# Altium schematic sheet Chassis.SchDoc
size 393 x 241 mm
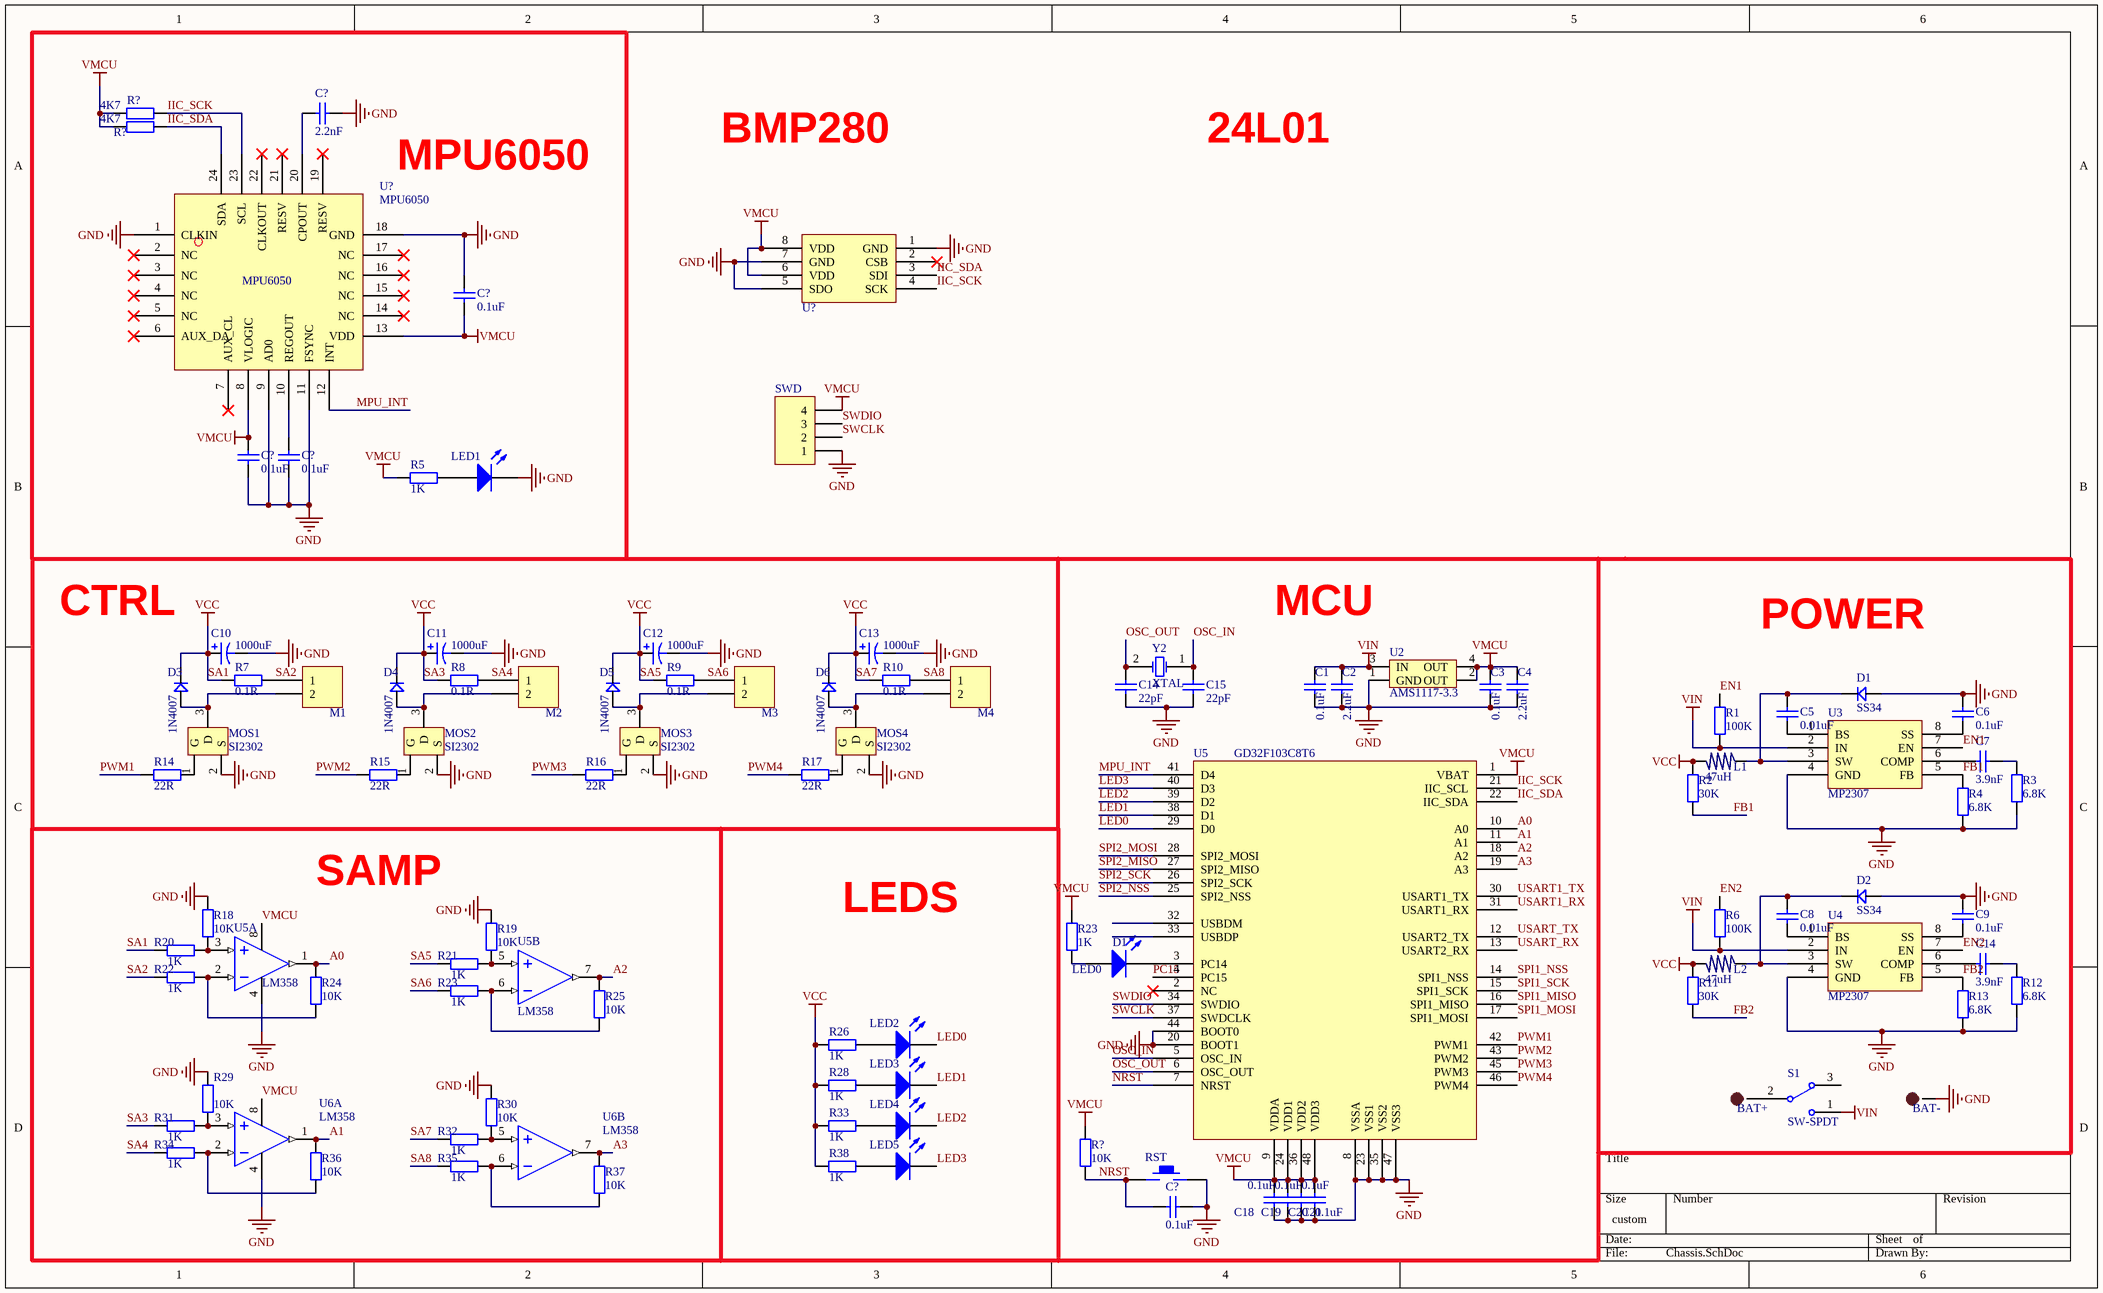
[diagram p0: Chassis.SchDoc]

## Parts
(Parts that share a designator on the sheet are numbered #1, #2 ... from top to bottom, then left to right.)
BAT+  SPK+  [TP-1.5]  (value not drawn)
BAT-  SPK+  [TP-1.5]  (value not drawn)
C1  value 0.1uF  [0603P]  (hidden comment: Cap)
C2  value 2.2uF  [0603P]  (hidden comment: Cap)
C3  value 0.1uF  [0603P]  (hidden comment: Cap)
C4  value 2.2uF  [0603P]  (hidden comment: Cap)
C5  value 0.01uF  [0603P]  (hidden comment: Cap)
C6  value 0.1uF  [0603P]  (hidden comment: Cap)
C7  value 3.9nF  [0603P]  (hidden comment: Cap)
C8  value 0.01uF  [0603P]  (hidden comment: Cap)
C9  value 0.1uF  [0603P]  (hidden comment: Cap)
C10  value 1000uF  [C-RB-5.0/13]  (hidden comment: Cap Pol1)
C11  value 1000uF  [C-RB-5.0/13]  (hidden comment: Cap Pol1)
C12  value 1000uF  [C-RB-5.0/13]  (hidden comment: Cap Pol1)
C13  value 1000uF  [C-RB-5.0/13]  (hidden comment: Cap Pol1)
C14#1  value 22pF  [0603P]  (hidden comment: Cap)
C14#2  value 3.9nF  [0603P]  (hidden comment: Cap)
C15  value 22pF  [0603P]  (hidden comment: Cap)
C18  value 0.1uF  [0603P]  (hidden comment: Cap)
C19  value 0.1uF  [0603P]  (hidden comment: Cap)
C20  value 0.1uF  [0603P]  (hidden comment: Cap)
C21  value 0.1uF  [0603P]  (hidden comment: Cap)
C?#1  value 2.2nF  [RAD-0.3]  (hidden comment: Cap)
C?#2  value 0.1uF  [RAD-0.3]  (hidden comment: Cap)
C?#3  value 0.1uF  [RAD-0.3]  (hidden comment: Cap)
C?#4  value 0.1uF  [RAD-0.3]  (hidden comment: Cap)
C?#5  value 0.1uF  [RAD-0.3]  (hidden comment: Cap)
D1#1  SS34  [SOD-123]
D1#2  LED0  [DIODE_SOP]
D2  SS34  [SOD-123]
D3  1N4007  [SOD-123]
D4  1N4007  [SOD-123]
D5  1N4007  [SOD-123]
D6  1N4007  [SOD-123]
L1  47uH  [0603P]
L2  47uH  [0603P]
LED1  LED1  [LED-1206]  (value not drawn)
LED2  LED1  [LED-1206]  (value not drawn)
LED3  LED1  [LED-1206]  (value not drawn)
LED4  LED1  [LED-1206]  (value not drawn)
LED5  LED1  [LED-1206]  (value not drawn)
M1  Header 2  [HDR1X2]  (value not drawn)
M2  Header 2  [HDR1X2]  (value not drawn)
M3  Header 2  [HDR1X2]  (value not drawn)
M4  Header 2  [HDR1X2]  (value not drawn)
MOS1  SI2302  [SO-G3/C2.5]
MOS2  SI2302  [SO-G3/C2.5]
MOS3  SI2302  [SO-G3/C2.5]
MOS4  SI2302  [SO-G3/C2.5]
R1  value 100K  [0603P]  (hidden comment: Res2)
R2  value 30K  [0603P]  (hidden comment: Res2)
R3  value 6.8K  [0603P]  (hidden comment: Res2)
R4  value 6.8K  [0603P]  (hidden comment: Res2)
R5  value 1K  [0603P]  (hidden comment: Res2)
R6  value 100K  [0603P]  (hidden comment: Res2)
R7  value 0.1R  [2512]  (hidden comment: Res2)
R8  value 0.1R  [2512]  (hidden comment: Res2)
R9  value 0.1R  [2512]  (hidden comment: Res2)
R10  value 0.1R  [2512]  (hidden comment: Res2)
R11  value 30K  [0603p]  (hidden comment: Res2)
R12  value 6.8K  [0603p]  (hidden comment: Res2)
R13  value 6.8K  [0603p]  (hidden comment: Res2)
R14  value 22R  [0603p]  (hidden comment: Res2)
R15  value 22R  [0603p]  (hidden comment: Res2)
R16  value 22R  [0603p]  (hidden comment: Res2)
R17  value 22R  [0603p]  (hidden comment: Res2)
R18  value 10K  [0603p]  (hidden comment: Res2)
R19  value 10K  [0603p]  (hidden comment: Res2)
R20  value 1K  [0603p]  (hidden comment: Res2)
R21  value 1K  [0603p]  (hidden comment: Res2)
R22  value 1K  [0603p]  (hidden comment: Res2)
R23#1  value 1K  [0603P]  (hidden comment: Res2)
R23#2  value 1K  [0603p]  (hidden comment: Res2)
R24  value 10K  [0603p]  (hidden comment: Res2)
R25  value 10K  [0603p]  (hidden comment: Res2)
R26  value 1K  [0603p]  (hidden comment: Res2)
R28  value 1K  [0603p]  (hidden comment: Res2)
R29  value 10K  [0603p]  (hidden comment: Res2)
R30  value 10K  [0603p]  (hidden comment: Res2)
R31  value 1K  [0603p]  (hidden comment: Res2)
R32  value 1K  [0603p]  (hidden comment: Res2)
R33  value 1K  [0603p]  (hidden comment: Res2)
R34  value 1K  [0603p]  (hidden comment: Res2)
R35  value 1K  [0603p]  (hidden comment: Res2)
R36  value 10K  [0603p]  (hidden comment: Res2)
R37  value 10K  [0603p]  (hidden comment: Res2)
R38  value 1K  [0603p]  (hidden comment: Res2)
R?#1  value 4K7  [AXIAL-0.4]  (hidden comment: Res2)
R?#2  value 4K7  [AXIAL-0.4]  (hidden comment: Res2)
R?#3  value 10K  [AXIAL-0.4]  (hidden comment: Res2)
RST  KEY_M  [KEY_SOP3625]  (value not drawn)
S1  SW-SPDT  [SWITCH_A3]
SWD  Header 4  [HDR1X4]  (value not drawn)
U2  AMS1117-3.3  [AMS1117]
U3  MP2307  [SOP-8]
U4  MP2307  [SOP-8]
U5#1  LM358  [SOIC-8]  (parts A,B of 2)
U5#2  GD32F103C8T6  [LQFP48_M]
U6  LM358  [SOIC-8]  (parts A,B of 2)
U?#1  MPU6050  [QFN-24]
U?#2  BMP280  (value not drawn)
Y2  XTAL  [XTAL_US]

## Nets
GND: BAT-.1 C1.1 C2.1 C3.1 C4.1 C6.2 C9.2 C10.2 C11.2 C12.2 C13.2 C14#1.2 C15.2 C18.1 C19.1 C20.1 C21.1 C?#1.2 C?#2.2 C?#3.1 C?#4.1 C?#5.2 D1#1.1 D2.1 LED1.2(K) MOS1.2(S) MOS2.2(S) MOS3.2(S) MOS4.2(S) R3.1 R4.1 R12.1 R13.1 R18.2 R19.2 R29.2 R30.2 RST.2 SWD.1 U2.1(GND) U3.4(GND) U4.4(GND) U5#1.4(V-) U5#2.8(VSSA) U5#2.20(BOOT1) U5#2.23(VSS1) U5#2.35(VSS2) U5#2.44(BOOT0) U5#2.47(VSS3) U6.4(V-) U?#1.1(CLKIN) U?#1.9(AD0) U?#1.11(FSYNC) U?#1.18(GND) U?#2.1(GND) U?#2.5(SDO) U?#2.7(GND)
SA1: C10.1 C11.1 C12.1 C13.1 D3.2 D4.2 D5.2 D6.2 L1.2 L2.2 R2.2 R7.1 R8.1 R9.1 R10.1 R11.2 R20.1 R21.1 R26.1 R28.1 R31.1 R32.1 R33.1 R38.1  [also labelled SA3, SA5, SA7, VCC]
VIN: C1.2 C2.2 R1.1 R6.1 S1.1 U2.3(IN) U3.2(IN) U4.2(IN)
VMCU: C3.2 C4.2 C18.2 C19.2 C20.2 C21.2 C?#2.1 C?#3.2 R5.1 R23#1.1 R?#1.1 R?#2.1 R?#3.2 SWD.4 U2.2(OUT) U2.4(OUT) U5#1.8(V+) U5#2.1(VBAT) U5#2.9(VDDA) U5#2.24(VDD1) U5#2.36(VDD2) U5#2.48(VDD3) U6.8(V+) U?#1.8(VLOGIC) U?#1.13(VDD) U?#2.6(VDD) U?#2.8(VDD)
A0: R24.2 U5#1.1(OUT) U5#2.10(A0)
A1: R36.2 U5#2.11(A1) U6.1(OUT)
A2: R25.2 U5#1.7(OUT) U5#2.18(A2)
A3: R37.2 U5#2.19(A3) U6.7(OUT)
EN1: R1.2 U3.7(EN)
EN2: R6.2 U4.7(EN)
FB1: R2.1 R4.2 U3.5(FB)
FB2: R11.1 R13.2 U4.5(FB)
IIC_SCK: R?#1.2 U5#2.21(IIC_SCL) U?#1.23(SCL) U?#2.4(SCK)
IIC_SDA: R?#2.2 U5#2.22(IIC_SDA) U?#1.24(SDA) U?#2.3(SDI)
LED0: LED2.2(K) U5#2.29(D0)
LED1: LED3.2(K) U5#2.38(D1)
LED2: LED4.2(K) U5#2.39(D2)
LED3: LED5.2(K) U5#2.40(D3)
MPU_INT: U5#2.41(D4) U?#1.12(INT)
NRST: C?#5.1 R?#3.1 RST.1 U5#2.7(NRST)
OSC_IN: C15.1 U5#2.5(OSC_IN) Y2.1(OSC1)
OSC_OUT: C14#1.1 U5#2.6(OSC_OUT) Y2.2(OSC2)
PC15: U5#2.4(PC15)
PWM1: R14.1 U5#2.42(PWM1)
PWM2: R15.1 U5#2.43(PWM2)
PWM3: R16.1 U5#2.45(PWM3)
PWM4: R17.1 U5#2.46(PWM4)
SA2: M1.1 R7.2 R22.1
SA4: M2.1 R8.2 R34.1
SA6: M3.1 R9.2 R23#2.1
SA8: M4.1 R10.2 R35.1
SPI1_MISO: U5#2.16(SPI1_MISO)
SPI1_MOSI: U5#2.17(SPI1_MOSI)
SPI1_NSS: U5#2.14(SPI1_NSS)
SPI1_SCK: U5#2.15(SPI1_SCK)
SPI2_MISO: U5#2.27(SPI2_MISO)
SPI2_MOSI: U5#2.28(SPI2_MOSI)
SPI2_NSS: U5#2.25(SPI2_NSS)
SPI2_SCK: U5#2.26(SPI2_SCK)
SWCLK: SWD.2 U5#2.37(SWDCLK)
SWDIO: SWD.3 U5#2.34(SWDIO)
USART1_RX: U5#2.31(USART1_RX)
USART1_TX: U5#2.30(USART1_TX)
USART_RX: U5#2.13(USART2_RX)
USART_TX: U5#2.12(USART2_TX)
NetBAT+_1: BAT+.1 S1.2
NetC5_1: C5.1 U3.1(BS)
NetC5_2: C5.2 D1#1.2 L1.1 U3.3(SW)
NetC6_1: C6.1 U3.8(SS)
NetC7_1: C7.1 R3.2
NetC7_2: C7.2 U3.6(COMP)
NetC8_1: C8.1 U4.1(BS)
NetC8_2: C8.2 D2.2 L2.1 U4.3(SW)
NetC9_1: C9.1 U4.8(SS)
NetC14#2_1: C14#2.1 R12.2
NetC14#2_2: C14#2.2 U4.6(COMP)
NetC?#1_1: C?#1.1 U?#1.20(CPOUT)
NetC?#4_2: C?#4.2 U?#1.10(REGOUT)
NetD1#2_1: D1#2.1(A) R23#1.2
NetD1#2_2: D1#2.2(K) U5#2.3(PC14)
NetD3_1: D3.1 M1.2 MOS1.3(D)
NetD4_1: D4.1 M2.2 MOS2.3(D)
NetD5_1: D5.1 M3.2 MOS3.3(D)
NetD6_1: D6.1 M4.2 MOS4.3(D)
NetLED1_1: LED1.1(A) R5.2
NetLED2_1: LED2.1(A) R26.2
NetLED3_1: LED3.1(A) R28.2
NetLED4_1: LED4.1(A) R33.2
NetLED5_1: LED5.1(A) R38.2
NetMOS1_1: MOS1.1(G) R14.2
NetMOS2_1: MOS2.1(G) R15.2
NetMOS3_1: MOS3.1(G) R16.2
NetMOS4_1: MOS4.1(G) R17.2
NetR18_1: R18.1 R20.2 U5#1.3(IN+)
NetR19_1: R19.1 R21.2 U5#1.5(IN+)
NetR22_2: R22.2 R24.1 U5#1.2(IN-)
NetR23#2_2: R23#2.2 R25.1 U5#1.6(IN-)
NetR29_1: R29.1 R31.2 U6.3(IN+)
NetR30_1: R30.1 R32.2 U6.5(IN+)
NetR34_2: R34.2 R36.1 U6.2(IN-)
NetR35_2: R35.2 R37.1 U6.6(IN-)

Not connected (* = marked no-connect by the designer): S1 3; U5#2 2(NC)* 32(USBDM) 33(USBDP); U?#1 2(NC)* 3(NC)* 4(NC)* 5(NC)* 6(AUX_DA)* 7(AUX_CL)* 14(NC)* 15(NC)* 16(NC)* 17(NC)* 19(RESV)* 21(RESV)* 22(CLKOUT)*; U?#2 2(CSB)*

## Notes on the sheet
- BMP280
- 24L01
- (near U?#1) MPU6050
- CTRL
- MCU
- POWER
- SAMP
- LEDS

## Library data of the parts
BAT+ BAT- = TEST-POINT: 测试点
C1-C9 C14#1 C14#2 C15 C18-C21 C?#1-C?#5 = Cap: Capacitor; Published: 8-Jun-2000; LatestRevisionDate: 17-Jul-2002; LatestRevisionNote: Re-released for DXP Platform.; PackageReference: RAD-0.3; Publisher: Altium Limited; PackageDescription: Radial Cap, Thru-Hole; 2 Leads; 0.3 in Pin Spacing
C10-C13 = Cap Pol1: Polarized Capacitor (Radial); Published: 8-Jun-2000; LatestRevisionDate: 17-Jul-2002; LatestRevisionNote: Re-released for DXP Platform.; PackageReference: RB7.6-15; Publisher: Altium Limited; PackageDescription: Polarized Capacitor (Radial); 2 Leads
D1#1 D2-D6 = D
D1#2 = LED0: Typical INFRARED GaAs LED; Published: 8-Jun-2000; LatestRevisionDate: 08-Jul-2005; LatestRevisionNote: Mech Layer 1 removed.; PackageReference: LED-0; Publisher: Altium Limited; PackageDescription: LED; 2 Leads
L1 L2 = L
LED1-LED5 = LED2: Typical RED, GREEN, YELLOW, AMBER GaAs LED; Published: 8-Jun-2000; LatestRevisionDate: 17-Jul-2002; LatestRevisionNote: Re-released for DXP Platform.; PackageDocument: Feb-2002; PackageReference: 3.2X1.6X1.1; Publisher: Altium Limited
M1-M4 = Header 2: Header, 2-Pin; LatestRevisionDate: 17-Jul-2002; LatestRevisionNote: Re-released for DXP Platform.; Publisher: Altium Limited
MOS1-MOS4 = MOS-P: IRLML6401/SI2301
R1-R22 R23#1 R23#2 R24-R26 R28-R38 R?#1-R?#3 = Res2: Resistor; Published: 8-Jun-2000; LatestRevisionDate: 17-Jul-2002; LatestRevisionNote: Re-released for DXP Platform.; PackageReference: AXIAL-0.4; Publisher: Altium Limited; PackageDescription: Axial Device, Thru-Hole; 2 Leads; 0.4 in Pin Spacing
S1 = SW-SPDT: 开关; Published: 24-Mar-1999; LatestRevisionDate: 17-Dec-2003; LatestRevisionNote: Schematic revised, PCB Footprint replaced.; DatasheetDocument: 05-Dec-2000; PackageReference: TL36WW15050; Publisher: Altium Limited; ComponentLink1Description: Manufacturer Link; ComponentLink1URL: http://www.apem.com
SWD = Header 4: Header, 4-Pin; LatestRevisionDate: 17-Jul-2002; LatestRevisionNote: Re-released for DXP Platform.; Publisher: Altium Limited
U2 = AMS1117
U5#1 U6 = LM358: 双运放
U5#2 = STM32F103C8T6
Y2 = XTAL: Crystal Oscillator; Published: 8-Jun-2000; LatestRevisionDate: 17-Jul-2002; LatestRevisionNote: Re-released for DXP Platform.; PackageReference: R38; Publisher: Altium Limited; PackageDescription: Crystal, Thru-Hole; 2 Leads; Body 3.1 x 8.2 mm (Dia.xH)